# EasyEDA Pro project 测试用途.eprj, board PCB1
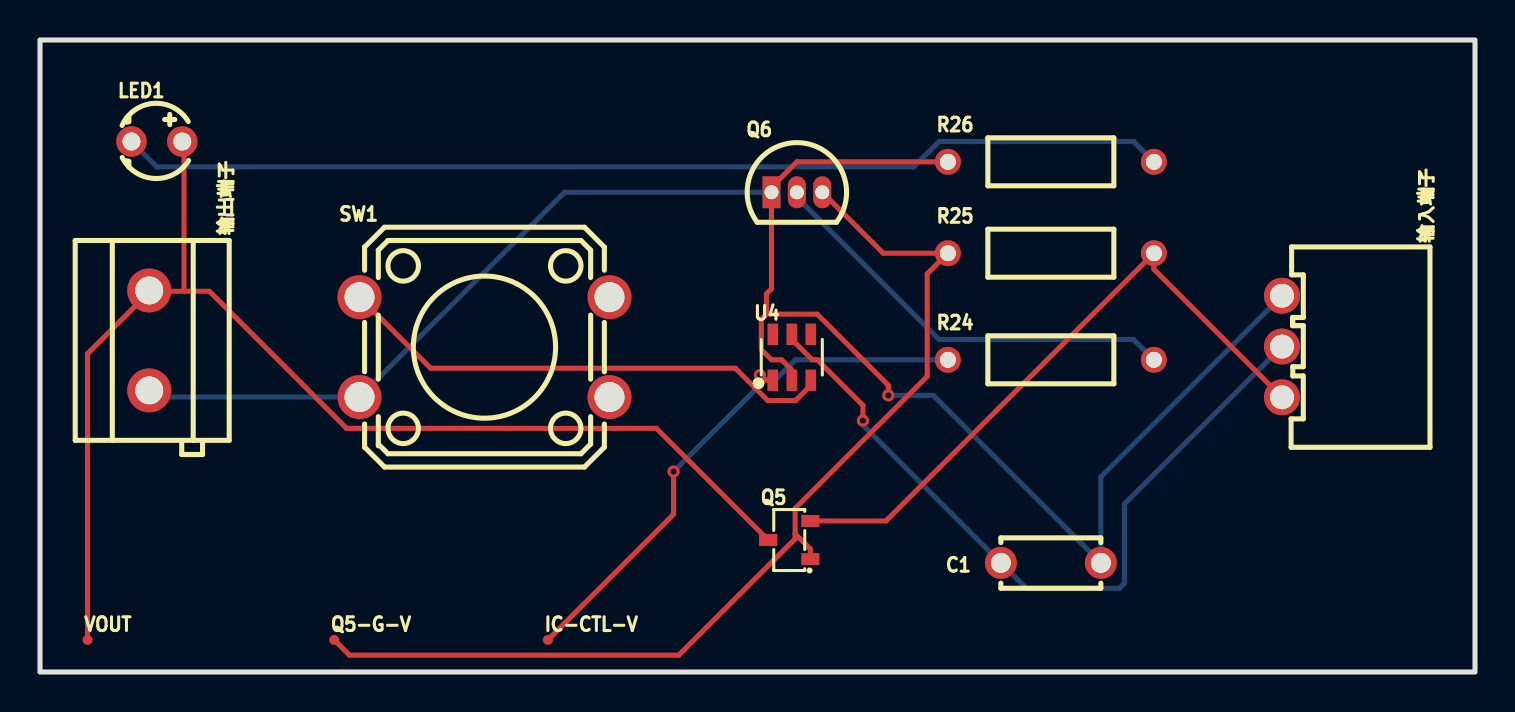
[diagram p5: board, top side]
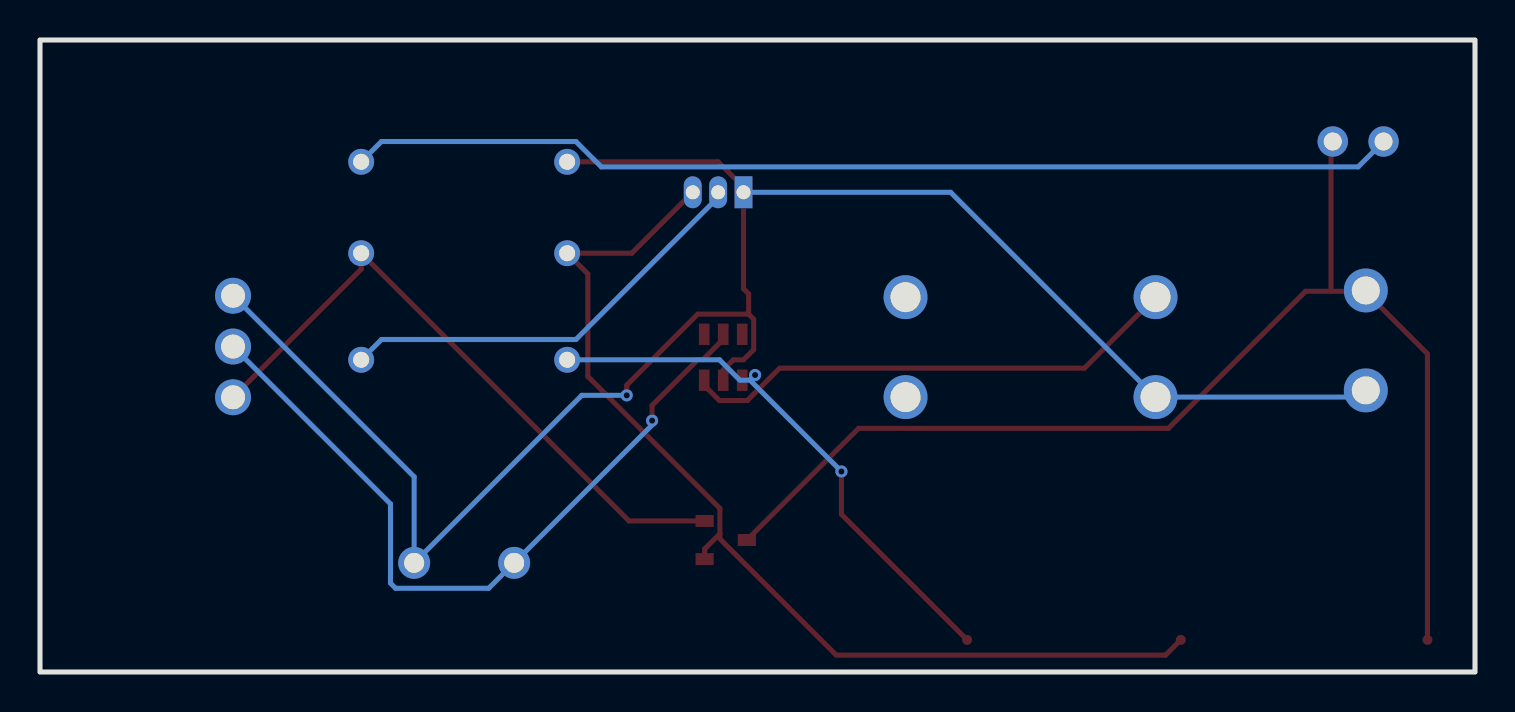
[diagram p6: board, bottom side, seen from below]

Outline 71.75 x 31.62 mm; copper layers: Top Layer, Bottom Layer. Coordinates in mm from the lower left corner of the outline.
Outline path: rectangle 0,31.62 71.75,0
Stack: Top Layer 0.035mm / Dielectric1 1.51mm FR4 er 4.5 / Bottom Layer 0.035mm

## Design rules (mm)
template: JLCPCB Capability(Two Layers Board)
spacing copperThickness1oz (default): track to track 0.102, other pairs 0.152 to 0.3
spacing copperThickness2oz: track to track 0.203, other pairs 0.152 to 0.3
track width copperThickness1oz (default): min 0.127, default 0.254, max 2.54
track width copperThickness2oz: min 0.203, default 0.254, max 2.54
differential pair differentialPair (default): width min 0.127, default 0.254, max 2.54; gap min 0.152, default 0.152
via viaSize (default): diameter min 0.5, default 0.61, max 10; hole min 0.3, default 0.305, max 6.3

## Placement (name value [footprint] x y rotation side)
C1  100nF  [CAP-TH_L5.0-W2.5-P5.00-D1.0]  50.55 5.46 0 top
IC-CTL-V  -  [Test-Point-0.5mm]  25.4 1.61 0 top
LED1  XL-302SURD  [LED-TH_BD3.8-P2.54-RD]  5.84 26.54 0 top
Q5  AO3401  [SOT-23-3_L2.9-W1.4-P1.90-LS2.6-BR]  37.46 6.6 0 top
Q5-G-V  -  [Test-Point-0.5mm]  14.71 1.61 0 top
Q6  2N7000  [TO-92-3_L4.9-W3.7-P1.27-L]  37.85 24 0 top
R24  1kΩ  [RES-TH_BD2.4-L6.3-P10.30-D0.6]  50.55 15.62 0 top
R25  100kΩ  [RES-TH_BD2.4-L6.3-P10.30-D0.6]  50.55 20.95 0 top
R26  280Ω  [RES-TH_BD2.4-L6.3-P10.30-D0.6]  50.55 25.53 0 top
SW1  K2-1103DP-M4SW-04  [SW-TH_4P-L12.0-W12.0-P5.00-LS12.5_TC-1103XX]  22.23 16.26 0 top
U4  EC190708-3-29CE-EBD7  [SOT-23-6_L2.9-W1.6-P0.95-LS2.9-BL]  37.59 15.75 0 top
VOUT  -  [Test-Point-0.5mm]  2.38 1.61 0 top
输入端子  XH-3AW  [CONN-TH_3P-P2.54_HCTL_XH-3AW]  62.1 16.29 270 top
输出端子  KF301-5.0-2P  [CONN-TH_P5.00_KF301-5.0-2P]  5.46 16.59 270 top

## Footprints (pads in the part's own frame, mm; a bottom-side part is the same pattern mirrored in y, then rotated)
CAP-TH_L5.0-W2.5-P5.00-D1.0
  round 1.6 hole 1: 1(-2.5,0) 2(2.5,0)
CONN-TH_3P-P2.54_HCTL_XH-3AW
  round 1.8 hole 1.199: 1(-2.54,0) 2(0.002,0) 3(2.54,0)
CONN-TH_P5.00_KF301-5.0-2P
  round 2.2 hole 1.4: 1(-2.5,0) 2(2.5,0)
LED-TH_BD3.8-P2.54-RD
  round 1.524 hole 0.9: 1(-1.27,0) 2(1.27,0)
RES-TH_BD2.4-L6.3-P10.30-D0.6
  round 1.3 hole 0.8: 1(-5.15,0) 2(5.15,0)
SOT-23-3_L2.9-W1.4-P1.90-LS2.6-BR
  rect 0.91x0.6 smd: 1(1.055,-0.955) 2(1.055,0.955) 3(-1.055,0)
SOT-23-6_L2.9-W1.6-P0.95-LS2.9-BL
  rect 0.532x1.072 smd: 1(-0.95,-1.149) 2(0,-1.149) 3(0.95,-1.149) 4(0.95,1.149) 5(0,1.149) 6(-0.95,1.149)
SW-TH_4P-L12.0-W12.0-P5.00-LS12.5_TC-1103XX
  round 2.2 hole 1.5: 1(-6.25,2.5) 2(6.25,2.5) 3(-6.25,-2.5) 4(6.25,-2.5)
Test-Point-0.5mm
  round 0.5 smd: 1(0,0)
TO-92-3_L4.9-W3.7-P1.27-L
  rect 0.9x1.6 hole 0.7: 1(-1.27,0)
  oval 0.9x1.6 hole 0.7: 2(0,0) 3(1.27,0)

## Nets
As in the schematic.

Pads without a net: SW1 2 4; U4 4 6

## Via types
v1: diameter 0.61, hole 0.305, Top Layer to Bottom Layer, 4 vias

## Routing (per net, layer and track width the routed paths; a pad name or vN(x,y) marks a point on that pad's centre or on a via; arc(x,y) is an arc through that point)
GND: length 94.9
  Top Layer w0.254: 36.32,17.91 38.86,17.91 42.42,14.35 v1(42.42,13.84) ; 36.32,17.91 36.07,17.65 36.07,16.13 36.58,15.62 37.08,15.62 37.59,15.11 U4.2 ; 36.32,17.91 36.32,18.92 36.58,19.18 Q6.1 36.58,24.26 37.85,25.53 R26.1
  Bottom Layer w0.254: 输入端子.1 53.05,9.77 C1.2 44.66,13.84 v1(42.42,13.84) ; 输出端子.2 5.8,13.76 SW1.3 26.22,24 Q6.1
VCC: length 62.4
  Top Layer w0.254: 7.2,19.05 7.2,26.45 LED1.2 ; 7.2,19.05 8.47,19.05 15.33,12.19 30.82,12.19 Q5.3 ; 7.2,19.05 5.5,19.05 ; 5.5,19.05 输出端子.1 ; 5.5,19.05 2.38,15.92 VOUT.1
V-BAT-1S: length 37.8
  Top Layer w0.254: U4.5 37.59,16.64 38.61,15.63 38.86,15.63 41.15,13.34 v1(41.15,12.58)
  Bottom Layer w0.254: v1(41.15,12.58) 41.15,12.36 C1.1 49.32,4.19 53.98,4.19 54.23,4.45 54.23,8.41 输入端子.2
V-BAT-2S: length 32.6
  Top Layer w0.254: 输入端子.3 55.7,20.15 55.7,20.95 42.3,7.56 Q5.2
$1N406: length 28.2
  Top Layer w0.254: v1(36,14.86) 36.25,14.61 36.64,14.61 ; v1(31.68,10.03) 31.68,7.89 IC-CTL-V.1
  Bottom Layer w0.254: 36.25,14.61 v1(31.68,10.03) ; 36.25,14.61 v1(36,14.86) ; 36.25,14.61 36.76,14.61 37.78,15.62 R24.1
$1N407: length 25.3
  Top Layer w0.254: SW1.1 19.53,15.2 34.77,15.2 36.39,13.58 37.78,13.58 38.54,14.34 U4.3
$1N410: length 52.4
  Top Layer w0.254: 37.76,6.92 37.76,6.67 31.94,0.85 15.47,0.85 Q5-G-V.1 ; 37.76,6.92 37.76,8.19 44.36,14.79 44.36,19.92 R25.1 42.16,20.95 Q6.3 ; 37.76,6.92 38.52,6.16 Q5.1
$1N412: length 21.5
  Bottom Layer w0.254: 55.7,15.62 54.68,16.64 44.96,16.64 37.85,23.75 Q6.2
$1N1137: length 52.6
  Bottom Layer w0.254: 55.7,25.53 54.68,26.54 44.96,26.54 43.69,25.27 5.84,25.27 4.57,26.54
